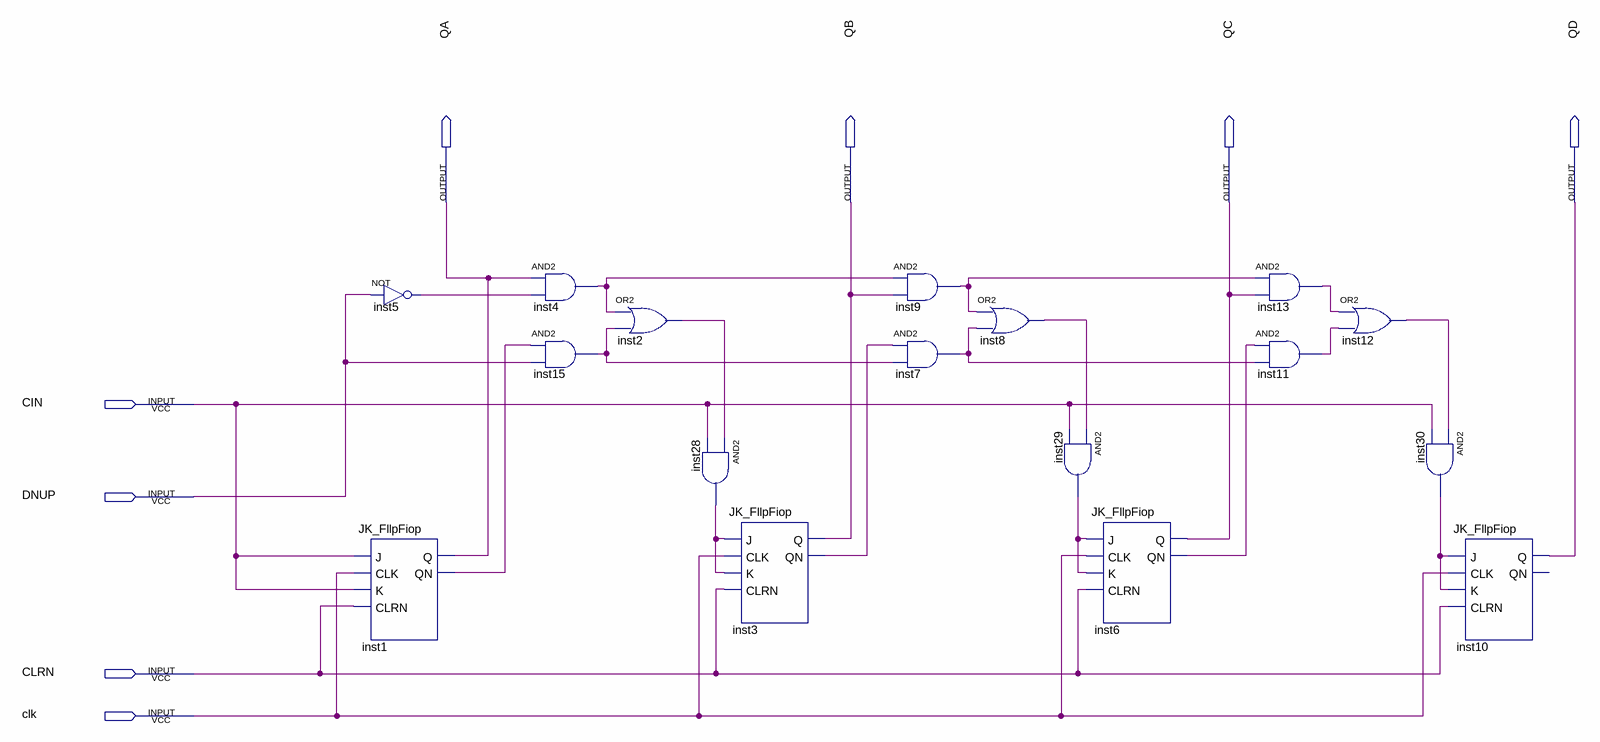
[diagram p0: schematic sheet]
// Quartus schematic Counter_Up_Down_4bit.bdf as structural Verilog: 17 symbols, 8 pins
module Counter_Up_Down_4bit (
  input  CIN,
  input  DNUP,
  input  CLRN,
  input  clk,
  output QA,
  output QB,
  output QC,
  output QD
);

  wire inst1_qn, inst2_out, inst3_qn, inst4_out, inst5_out, inst6_qn, inst7_out, inst8_out, inst9_out,
       inst11_out, inst12_out, inst13_out, inst15_out, inst28_out, inst29_out, inst30_out;

  not inst5 (inst5_out, DNUP);
  JK_FllpFiop inst1 (.J(CIN), .CLK(clk), .K(CIN), .CLRN(CLRN), .Q(QA), .QN(inst1_qn));
  and inst4 (inst4_out, QA, inst5_out);
  and inst15 (inst15_out, inst1_qn, DNUP);
  or inst2 (inst2_out, inst4_out, inst15_out);
  and inst28 (inst28_out, inst2_out, CIN);
  JK_FllpFiop inst3 (.J(inst28_out), .CLK(clk), .K(inst28_out), .CLRN(CLRN), .Q(QB), .QN(inst3_qn));
  and inst9 (inst9_out, inst4_out, QB);
  and inst7 (inst7_out, inst3_qn, inst15_out);
  or inst8 (inst8_out, inst9_out, inst7_out);
  and inst29 (inst29_out, inst8_out, CIN);
  JK_FllpFiop inst6 (.J(inst29_out), .CLK(clk), .K(inst29_out), .CLRN(CLRN), .Q(QC), .QN(inst6_qn));
  and inst13 (inst13_out, inst9_out, QC);
  and inst11 (inst11_out, inst6_qn, inst7_out);
  or inst12 (inst12_out, inst13_out, inst11_out);
  and inst30 (inst30_out, inst12_out, CIN);
  JK_FllpFiop inst10 (.J(inst30_out), .CLK(clk), .K(inst30_out), .CLRN(CLRN), .Q(QD));  // open: QN
endmodule
